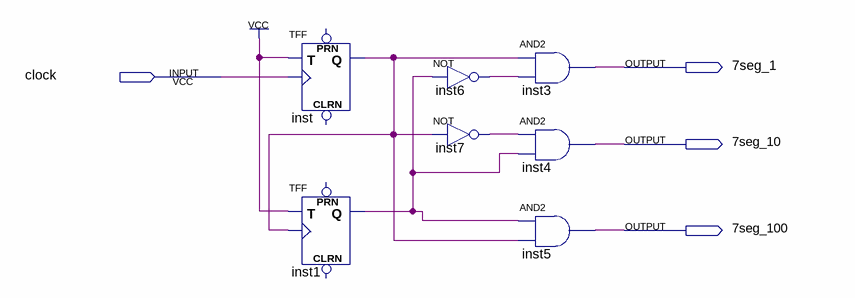
[diagram p0: schematic sheet]
// Quartus schematic Seletor_Display.bdf as structural Verilog: 7 symbols, 4 pins
module Seletor_Display (
  input  clock,
  output \7seg_1 ,
  output \7seg_10 ,
  output \7seg_100 
);

  wire inst1_q, inst6_out, inst7_out, inst_q;

  TFF inst (.T(1'b1), .CLK(clock), .Q(inst_q));  // open: PRN, CLRN
  TFF inst1 (.T(1'b1), .CLK(inst_q), .Q(inst1_q));  // open: PRN, CLRN
  not inst6 (inst6_out, inst1_q);
  not inst7 (inst7_out, inst_q);
  and inst3 (\7seg_1 , inst_q, inst6_out);
  and inst4 (\7seg_10 , inst7_out, inst1_q);
  and inst5 (\7seg_100 , inst1_q, inst_q);
endmodule
